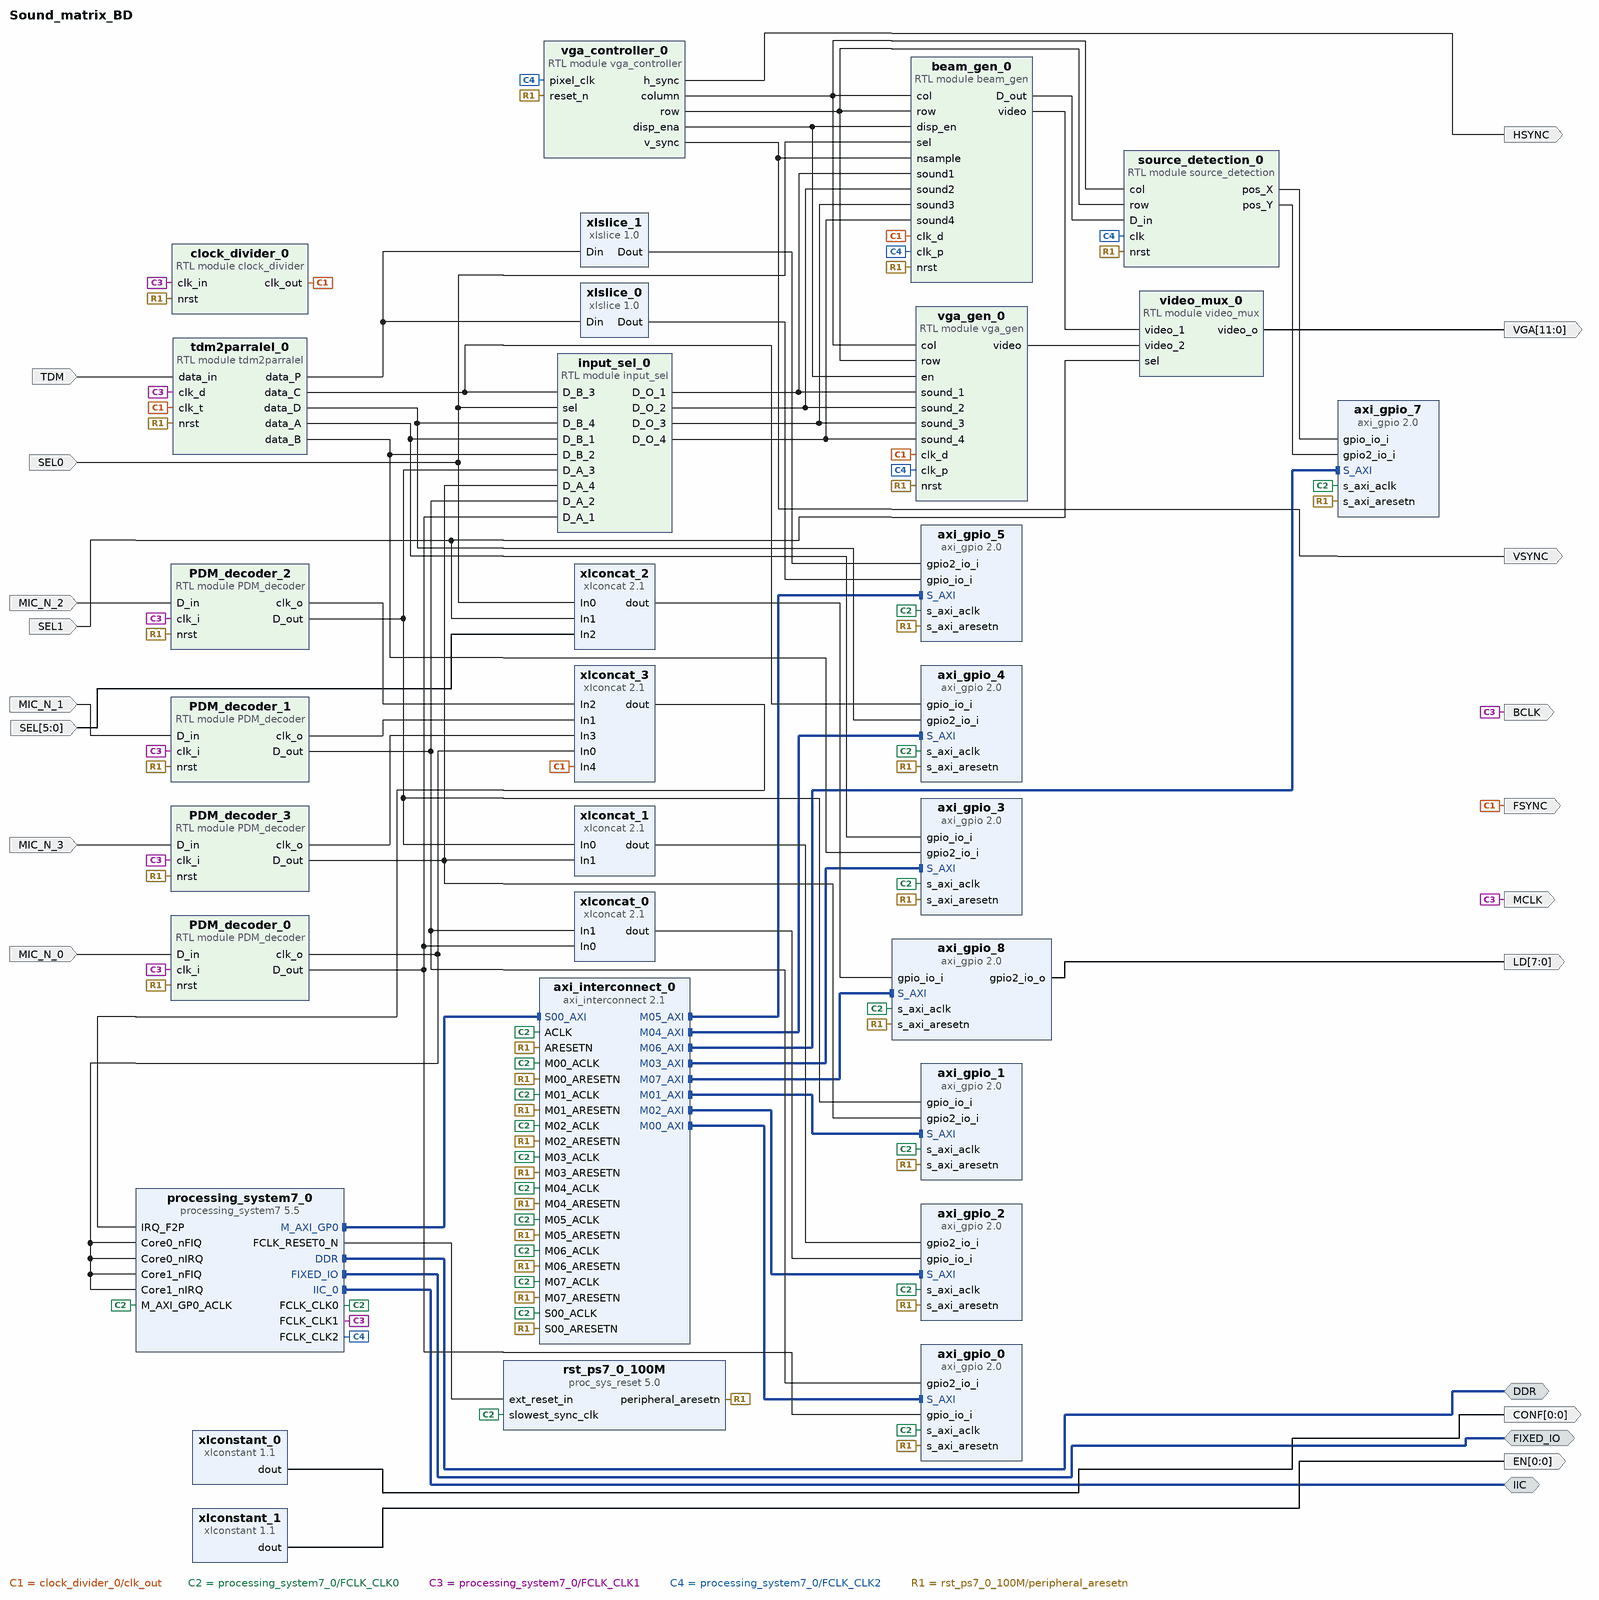
[diagram p0: block diagram of the top level]
# Vivado block design Sound_matrix_BD, xc7z020clg484-1, Vivado 2023.2.2
create_bd_design Sound_matrix_BD

create_bd_intf_port -mode Master -vlnv xilinx.com:interface:ddrx_rtl:1.0 DDR
create_bd_intf_port -mode Master -vlnv xilinx.com:display_processing_system7:fixedio_rtl:1.0 FIXED_IO
create_bd_intf_port -mode Master -vlnv xilinx.com:interface:iic_rtl:1.0 IIC
create_bd_port -dir I -type data MIC_N_0
create_bd_port -dir I -type data MIC_N_1
create_bd_port -dir I -type data MIC_N_2
create_bd_port -dir I -type data MIC_N_3
create_bd_port -dir I -type data TDM
create_bd_port -dir O -type clk MCLK
create_bd_port -dir O -type clk FSYNC
create_bd_port -dir O -type clk BCLK
create_bd_port -dir O -from 0 -to 0 -type data CONF
create_bd_port -dir O -from 0 -to 0 -type data EN
create_bd_port -dir I -type data SEL0
create_bd_port -dir O -type clk HSYNC
create_bd_port -dir O -type clk VSYNC
create_bd_port -dir I -type data SEL1
create_bd_port -dir O -from 11 -to 0 -type data VGA
create_bd_port -dir I -from 5 -to 0 -type data SEL
create_bd_port -dir O -from 7 -to 0 -type data LD

create_bd_cell -type ip -vlnv xilinx.com:ip:processing_system7:5.5 processing_system7_0
set_property -dict [list \
  CONFIG.PCW_APU_PERIPHERAL_FREQMHZ 666.666667 \
  CONFIG.PCW_CORE0_FIQ_INTR 1 \
  CONFIG.PCW_CORE0_IRQ_INTR 1 \
  CONFIG.PCW_CORE1_FIQ_INTR 1 \
  CONFIG.PCW_CORE1_IRQ_INTR 1 \
  CONFIG.PCW_ENET0_ENET0_IO {MIO 16 .. 27} \
  CONFIG.PCW_ENET0_GRP_MDIO_ENABLE 1 \
  CONFIG.PCW_ENET0_GRP_MDIO_IO {MIO 52 .. 53} \
  CONFIG.PCW_ENET0_PERIPHERAL_ENABLE 1 \
  CONFIG.PCW_ENET0_RESET_ENABLE 0 \
  CONFIG.PCW_ENET_RESET_ENABLE 1 \
  CONFIG.PCW_ENET_RESET_SELECT {Share reset pin} \
  CONFIG.PCW_EN_CLK1_PORT 1 \
  CONFIG.PCW_EN_CLK2_PORT 1 \
  CONFIG.PCW_FCLK_CLK1_BUF TRUE \
  CONFIG.PCW_FCLK_CLK2_BUF TRUE \
  CONFIG.PCW_FPGA0_PERIPHERAL_FREQMHZ 100.000000 \
  CONFIG.PCW_FPGA1_PERIPHERAL_FREQMHZ 3.072 \
  CONFIG.PCW_FPGA2_PERIPHERAL_FREQMHZ 25 \
  CONFIG.PCW_FPGA_FCLK1_ENABLE 1 \
  CONFIG.PCW_FPGA_FCLK2_ENABLE 1 \
  CONFIG.PCW_GPIO_EMIO_GPIO_ENABLE 1 \
  CONFIG.PCW_GPIO_EMIO_GPIO_IO 64 \
  CONFIG.PCW_GPIO_MIO_GPIO_ENABLE 1 \
  CONFIG.PCW_GPIO_MIO_GPIO_IO MIO \
  CONFIG.PCW_I2C0_I2C0_IO EMIO \
  CONFIG.PCW_I2C0_PERIPHERAL_ENABLE 1 \
  CONFIG.PCW_I2C_PERIPHERAL_FREQMHZ 111.111115 \
  CONFIG.PCW_I2C_RESET_ENABLE 1 \
  CONFIG.PCW_I2C_RESET_SELECT {Share reset pin} \
  CONFIG.PCW_IRQ_F2P_INTR 1 \
  CONFIG.PCW_PRESET_BANK1_VOLTAGE {LVCMOS 1.8V} \
  CONFIG.PCW_QSPI_GRP_SINGLE_SS_ENABLE 1 \
  CONFIG.PCW_QSPI_GRP_SINGLE_SS_IO {MIO 1 .. 6} \
  CONFIG.PCW_QSPI_PERIPHERAL_ENABLE 1 \
  CONFIG.PCW_QSPI_QSPI_IO {MIO 1 .. 6} \
  CONFIG.PCW_SD0_GRP_CD_ENABLE 1 \
  CONFIG.PCW_SD0_GRP_CD_IO {MIO 47} \
  CONFIG.PCW_SD0_GRP_WP_ENABLE 1 \
  CONFIG.PCW_SD0_GRP_WP_IO {MIO 46} \
  CONFIG.PCW_SD0_PERIPHERAL_ENABLE 1 \
  CONFIG.PCW_SD0_SD0_IO {MIO 40 .. 45} \
  CONFIG.PCW_SDIO_PERIPHERAL_FREQMHZ 50 \
  CONFIG.PCW_SINGLE_QSPI_DATA_MODE x4 \
  CONFIG.PCW_TTC0_PERIPHERAL_ENABLE 1 \
  CONFIG.PCW_TTC0_TTC0_IO EMIO \
  CONFIG.PCW_UART1_PERIPHERAL_ENABLE 1 \
  CONFIG.PCW_UART1_UART1_IO {MIO 48 .. 49} \
  CONFIG.PCW_UART_PERIPHERAL_FREQMHZ 50 \
  CONFIG.PCW_UIPARAM_DDR_FREQ_MHZ 533.333313 \
  CONFIG.PCW_UIPARAM_DDR_PARTNO {MT41J128M16 HA-15E} \
  CONFIG.PCW_USB0_PERIPHERAL_ENABLE 1 \
  CONFIG.PCW_USB0_RESET_ENABLE 0 \
  CONFIG.PCW_USB0_USB0_IO {MIO 28 .. 39} \
  CONFIG.PCW_USB_RESET_ENABLE 1 \
  CONFIG.PCW_USB_RESET_SELECT {Share reset pin} \
  CONFIG.PCW_USE_FABRIC_INTERRUPT 1 \
  CONFIG.preset ZedBoard \
] [get_bd_cells processing_system7_0]
# 228 more settings of processing_system7_0 are not shown: defaults, MIO pin electricals, DDR timing, and values the tool derives
create_bd_cell -type module -reference PDM_decoder PDM_decoder_0
create_bd_cell -type module -reference PDM_decoder PDM_decoder_1
create_bd_cell -type module -reference PDM_decoder PDM_decoder_2
create_bd_cell -type module -reference PDM_decoder PDM_decoder_3
create_bd_cell -type ip -vlnv xilinx.com:ip:axi_interconnect:2.1 axi_interconnect_0
set_property -dict {CONFIG.NUM_MI 8} [get_bd_cells axi_interconnect_0]
create_bd_cell -type ip -vlnv xilinx.com:ip:axi_gpio:2.0 axi_gpio_0
set_property -dict [list \
  CONFIG.C_ALL_INPUTS 1 \
  CONFIG.C_ALL_INPUTS_2 1 \
  CONFIG.C_GPIO2_WIDTH 16 \
  CONFIG.C_GPIO_WIDTH 16 \
  CONFIG.C_IS_DUAL 1 \
] [get_bd_cells axi_gpio_0]
create_bd_cell -type ip -vlnv xilinx.com:ip:axi_gpio:2.0 axi_gpio_1
set_property -dict [list \
  CONFIG.C_ALL_INPUTS 1 \
  CONFIG.C_ALL_INPUTS_2 1 \
  CONFIG.C_GPIO2_WIDTH 16 \
  CONFIG.C_GPIO_WIDTH 16 \
  CONFIG.C_IS_DUAL 1 \
] [get_bd_cells axi_gpio_1]
create_bd_cell -type ip -vlnv xilinx.com:ip:axi_gpio:2.0 axi_gpio_2
set_property -dict {CONFIG.C_ALL_INPUTS 1 CONFIG.C_ALL_INPUTS_2 1 CONFIG.C_IS_DUAL 1} [get_bd_cells axi_gpio_2]
create_bd_cell -type ip -vlnv xilinx.com:ip:xlconcat:2.1 xlconcat_0
set_property -dict {CONFIG.NUM_PORTS 2} [get_bd_cells xlconcat_0]
create_bd_cell -type ip -vlnv xilinx.com:ip:xlconcat:2.1 xlconcat_1
set_property -dict {CONFIG.NUM_PORTS 2} [get_bd_cells xlconcat_1]
create_bd_cell -type ip -vlnv xilinx.com:ip:axi_gpio:2.0 axi_gpio_7
set_property -dict [list \
  CONFIG.C_ALL_INPUTS 1 \
  CONFIG.C_ALL_INPUTS_2 1 \
  CONFIG.C_GPIO2_WIDTH 10 \
  CONFIG.C_GPIO_WIDTH 10 \
  CONFIG.C_IS_DUAL 1 \
] [get_bd_cells axi_gpio_7]
create_bd_cell -type module -reference tdm2parralel tdm2parralel_0
create_bd_cell -type ip -vlnv xilinx.com:ip:axi_gpio:2.0 axi_gpio_3
set_property -dict [list \
  CONFIG.C_ALL_INPUTS 1 \
  CONFIG.C_ALL_INPUTS_2 1 \
  CONFIG.C_GPIO2_WIDTH 16 \
  CONFIG.C_GPIO_WIDTH 16 \
  CONFIG.C_IS_DUAL 1 \
] [get_bd_cells axi_gpio_3]
create_bd_cell -type ip -vlnv xilinx.com:ip:axi_gpio:2.0 axi_gpio_4
set_property -dict [list \
  CONFIG.C_ALL_INPUTS 1 \
  CONFIG.C_ALL_INPUTS_2 1 \
  CONFIG.C_GPIO2_WIDTH 16 \
  CONFIG.C_GPIO_WIDTH 16 \
  CONFIG.C_IS_DUAL 1 \
] [get_bd_cells axi_gpio_4]
create_bd_cell -type ip -vlnv xilinx.com:ip:axi_gpio:2.0 axi_gpio_5
set_property -dict [list \
  CONFIG.C_ALL_INPUTS 1 \
  CONFIG.C_ALL_INPUTS_2 1 \
  CONFIG.C_GPIO2_WIDTH 32 \
  CONFIG.C_GPIO_WIDTH 32 \
  CONFIG.C_IS_DUAL 1 \
] [get_bd_cells axi_gpio_5]
create_bd_cell -type ip -vlnv xilinx.com:ip:xlslice:1.0 xlslice_0
set_property -dict {CONFIG.DIN_FROM 31 CONFIG.DIN_TO 0 CONFIG.DIN_WIDTH 64} [get_bd_cells xlslice_0]
create_bd_cell -type ip -vlnv xilinx.com:ip:xlslice:1.0 xlslice_1
set_property -dict {CONFIG.DIN_FROM 63 CONFIG.DIN_TO 32 CONFIG.DIN_WIDTH 64} [get_bd_cells xlslice_1]
create_bd_cell -type module -reference clock_divider clock_divider_0
create_bd_cell -type ip -vlnv xilinx.com:ip:xlconstant:1.1 xlconstant_0
set_property -dict {CONFIG.CONST_VAL 0} [get_bd_cells xlconstant_0]
create_bd_cell -type ip -vlnv xilinx.com:ip:xlconstant:1.1 xlconstant_1
create_bd_cell -type module -reference input_sel input_sel_0
create_bd_cell -type module -reference vga_controller vga_controller_0
create_bd_cell -type module -reference vga_gen vga_gen_0
set_property -dict [list \
  CONFIG.AVG_2_NUM 0 \
  CONFIG.AVG_NUM 1 \
  CONFIG.H_SPACE 160 \
  CONFIG.LINE_BUF 20 \
  CONFIG.MAX_BUFF 6 \
  CONFIG.V_SPACE 60 \
] [get_bd_cells vga_gen_0]
create_bd_cell -type module -reference video_mux video_mux_0
create_bd_cell -type module -reference beam_gen beam_gen_0
set_property -dict {CONFIG.MAX_SEL 8} [get_bd_cells beam_gen_0]
create_bd_cell -type ip -vlnv xilinx.com:ip:axi_gpio:2.0 axi_gpio_8
set_property -dict [list \
  CONFIG.C_ALL_INPUTS 1 \
  CONFIG.C_ALL_INPUTS_2 0 \
  CONFIG.C_ALL_OUTPUTS_2 1 \
  CONFIG.C_GPIO2_WIDTH 8 \
  CONFIG.C_GPIO_WIDTH 8 \
  CONFIG.C_IS_DUAL 1 \
] [get_bd_cells axi_gpio_8]
create_bd_cell -type ip -vlnv xilinx.com:ip:proc_sys_reset:5.0 rst_ps7_0_100M
create_bd_cell -type ip -vlnv xilinx.com:ip:xlconcat:2.1 xlconcat_2
set_property -dict {CONFIG.NUM_PORTS 3} [get_bd_cells xlconcat_2]
create_bd_cell -type module -reference source_detection source_detection_0
create_bd_cell -type ip -vlnv xilinx.com:ip:xlconcat:2.1 xlconcat_3
set_property -dict {CONFIG.NUM_PORTS 5} [get_bd_cells xlconcat_3]

# ---- connections ----

connect_bd_intf_net [get_bd_intf_pins axi_interconnect_0/S00_AXI] [get_bd_intf_pins processing_system7_0/M_AXI_GP0]
connect_bd_intf_net [get_bd_intf_pins axi_interconnect_0/M00_AXI] [get_bd_intf_pins axi_gpio_0/S_AXI]
connect_bd_intf_net [get_bd_intf_pins axi_interconnect_0/M01_AXI] [get_bd_intf_pins axi_gpio_1/S_AXI]
connect_bd_intf_net [get_bd_intf_pins axi_interconnect_0/M02_AXI] [get_bd_intf_pins axi_gpio_2/S_AXI]
connect_bd_intf_net [get_bd_intf_pins axi_interconnect_0/M03_AXI] [get_bd_intf_pins axi_gpio_3/S_AXI]
connect_bd_intf_net [get_bd_intf_pins axi_interconnect_0/M04_AXI] [get_bd_intf_pins axi_gpio_4/S_AXI]
connect_bd_intf_net [get_bd_intf_pins axi_interconnect_0/M05_AXI] [get_bd_intf_pins axi_gpio_5/S_AXI]
connect_bd_intf_net [get_bd_intf_pins axi_gpio_7/S_AXI] [get_bd_intf_pins axi_interconnect_0/M06_AXI]
connect_bd_intf_net [get_bd_intf_pins axi_gpio_8/S_AXI] [get_bd_intf_pins axi_interconnect_0/M07_AXI]
connect_bd_intf_net [get_bd_intf_ports DDR] [get_bd_intf_pins processing_system7_0/DDR]
connect_bd_intf_net [get_bd_intf_ports FIXED_IO] [get_bd_intf_pins processing_system7_0/FIXED_IO]
connect_bd_intf_net [get_bd_intf_ports IIC] [get_bd_intf_pins processing_system7_0/IIC_0]
connect_bd_net -net MIC_N_0_1 [get_bd_ports MIC_N_0] [get_bd_pins PDM_decoder_0/D_in]
connect_bd_net -net MIC_N_1_1 [get_bd_ports MIC_N_1] [get_bd_pins PDM_decoder_1/D_in]
connect_bd_net -net MIC_N_2_1 [get_bd_ports MIC_N_2] [get_bd_pins PDM_decoder_2/D_in]
connect_bd_net -net MIC_N_3_1 [get_bd_ports MIC_N_3] [get_bd_pins PDM_decoder_3/D_in]
connect_bd_net [get_bd_pins PDM_decoder_0/D_out] [get_bd_pins axi_gpio_0/gpio_io_i] [get_bd_pins xlconcat_0/In0] [get_bd_pins input_sel_0/D_A_1]
connect_bd_net [get_bd_pins PDM_decoder_0/clk_o] \
  [get_bd_pins xlconcat_3/In0] [get_bd_pins processing_system7_0/Core1_nIRQ] [get_bd_pins processing_system7_0/Core1_nFIQ] \
  [get_bd_pins processing_system7_0/Core0_nFIQ] [get_bd_pins processing_system7_0/Core0_nIRQ]
connect_bd_net [get_bd_pins PDM_decoder_1/D_out] [get_bd_pins axi_gpio_0/gpio2_io_i] [get_bd_pins xlconcat_0/In1] [get_bd_pins input_sel_0/D_A_2]
connect_bd_net [get_bd_pins PDM_decoder_1/clk_o] [get_bd_pins xlconcat_3/In1]
connect_bd_net [get_bd_pins PDM_decoder_2/D_out] [get_bd_pins axi_gpio_1/gpio_io_i] [get_bd_pins xlconcat_1/In0] [get_bd_pins input_sel_0/D_A_3]
connect_bd_net [get_bd_pins PDM_decoder_2/clk_o] [get_bd_pins xlconcat_3/In2]
connect_bd_net [get_bd_pins PDM_decoder_3/D_out] [get_bd_pins axi_gpio_1/gpio2_io_i] [get_bd_pins xlconcat_1/In1] [get_bd_pins input_sel_0/D_A_4]
connect_bd_net [get_bd_pins PDM_decoder_3/clk_o] [get_bd_pins xlconcat_3/In3]
connect_bd_net -net SEL0_1 [get_bd_ports SEL0] [get_bd_pins input_sel_0/sel] [get_bd_pins xlconcat_2/In0] [get_bd_pins beam_gen_0/sel]
connect_bd_net -net SEL1_1 [get_bd_ports SEL1] [get_bd_pins video_mux_0/sel] [get_bd_pins xlconcat_2/In1]
connect_bd_net [get_bd_ports SEL] [get_bd_pins xlconcat_2/In2]
connect_bd_net [get_bd_ports TDM] [get_bd_pins tdm2parralel_0/data_in]
connect_bd_net [get_bd_pins axi_gpio_8/gpio2_io_o] [get_bd_ports LD]
connect_bd_net [get_bd_pins beam_gen_0/D_out] [get_bd_pins source_detection_0/D_in]
connect_bd_net [get_bd_pins beam_gen_0/video] [get_bd_pins video_mux_0/video_1]
connect_bd_net [get_bd_pins clock_divider_0/clk_out] \
  [get_bd_ports FSYNC] [get_bd_pins tdm2parralel_0/clk_t] [get_bd_pins vga_gen_0/clk_d] [get_bd_pins xlconcat_3/In4] \
  [get_bd_pins beam_gen_0/clk_d]
connect_bd_net [get_bd_pins input_sel_0/D_O_1] [get_bd_pins vga_gen_0/sound_1] [get_bd_pins beam_gen_0/sound1]
connect_bd_net [get_bd_pins input_sel_0/D_O_2] [get_bd_pins vga_gen_0/sound_2] [get_bd_pins beam_gen_0/sound2]
connect_bd_net [get_bd_pins input_sel_0/D_O_3] [get_bd_pins vga_gen_0/sound_3] [get_bd_pins beam_gen_0/sound3]
connect_bd_net [get_bd_pins input_sel_0/D_O_4] [get_bd_pins vga_gen_0/sound_4] [get_bd_pins beam_gen_0/sound4]
connect_bd_net [get_bd_pins processing_system7_0/FCLK_CLK0] \
  [get_bd_pins processing_system7_0/M_AXI_GP0_ACLK] [get_bd_pins axi_gpio_0/s_axi_aclk] \
  [get_bd_pins axi_interconnect_0/M00_ACLK] [get_bd_pins rst_ps7_0_100M/slowest_sync_clk] [get_bd_pins axi_gpio_1/s_axi_aclk] \
  [get_bd_pins axi_interconnect_0/M01_ACLK] [get_bd_pins axi_gpio_2/s_axi_aclk] [get_bd_pins axi_interconnect_0/M02_ACLK] \
  [get_bd_pins axi_gpio_3/s_axi_aclk] [get_bd_pins axi_interconnect_0/M03_ACLK] [get_bd_pins axi_gpio_4/s_axi_aclk] \
  [get_bd_pins axi_interconnect_0/M04_ACLK] [get_bd_pins axi_gpio_5/s_axi_aclk] [get_bd_pins axi_interconnect_0/M05_ACLK] \
  [get_bd_pins axi_gpio_7/s_axi_aclk] [get_bd_pins axi_interconnect_0/M06_ACLK] [get_bd_pins axi_gpio_8/s_axi_aclk] \
  [get_bd_pins axi_interconnect_0/M07_ACLK] [get_bd_pins axi_interconnect_0/ACLK] [get_bd_pins axi_interconnect_0/S00_ACLK]
connect_bd_net [get_bd_pins processing_system7_0/FCLK_CLK1] \
  [get_bd_ports MCLK] [get_bd_pins clock_divider_0/clk_in] [get_bd_pins tdm2parralel_0/clk_d] [get_bd_ports BCLK] \
  [get_bd_pins PDM_decoder_0/clk_i] [get_bd_pins PDM_decoder_1/clk_i] [get_bd_pins PDM_decoder_2/clk_i] \
  [get_bd_pins PDM_decoder_3/clk_i]
connect_bd_net [get_bd_pins processing_system7_0/FCLK_CLK2] \
  [get_bd_pins vga_controller_0/pixel_clk] [get_bd_pins vga_gen_0/clk_p] [get_bd_pins beam_gen_0/clk_p] \
  [get_bd_pins source_detection_0/clk]
connect_bd_net [get_bd_pins processing_system7_0/FCLK_RESET0_N] [get_bd_pins rst_ps7_0_100M/ext_reset_in]
connect_bd_net [get_bd_pins rst_ps7_0_100M/peripheral_aresetn] \
  [get_bd_pins axi_gpio_0/s_axi_aresetn] [get_bd_pins axi_interconnect_0/M00_ARESETN] [get_bd_pins axi_gpio_1/s_axi_aresetn] \
  [get_bd_pins axi_interconnect_0/M01_ARESETN] [get_bd_pins axi_gpio_2/s_axi_aresetn] \
  [get_bd_pins axi_interconnect_0/M02_ARESETN] [get_bd_pins axi_gpio_3/s_axi_aresetn] \
  [get_bd_pins axi_interconnect_0/M03_ARESETN] [get_bd_pins axi_gpio_4/s_axi_aresetn] \
  [get_bd_pins axi_interconnect_0/M04_ARESETN] [get_bd_pins axi_gpio_5/s_axi_aresetn] \
  [get_bd_pins axi_interconnect_0/M05_ARESETN] [get_bd_pins axi_gpio_7/s_axi_aresetn] \
  [get_bd_pins axi_interconnect_0/M06_ARESETN] [get_bd_pins axi_gpio_8/s_axi_aresetn] \
  [get_bd_pins axi_interconnect_0/M07_ARESETN] [get_bd_pins axi_interconnect_0/ARESETN] \
  [get_bd_pins axi_interconnect_0/S00_ARESETN] [get_bd_pins vga_gen_0/nrst] [get_bd_pins vga_controller_0/reset_n] \
  [get_bd_pins tdm2parralel_0/nrst] [get_bd_pins clock_divider_0/nrst] [get_bd_pins beam_gen_0/nrst] \
  [get_bd_pins source_detection_0/nrst] [get_bd_pins PDM_decoder_0/nrst] [get_bd_pins PDM_decoder_1/nrst] \
  [get_bd_pins PDM_decoder_2/nrst] [get_bd_pins PDM_decoder_3/nrst]
connect_bd_net [get_bd_pins source_detection_0/pos_X] [get_bd_pins axi_gpio_7/gpio_io_i]
connect_bd_net [get_bd_pins source_detection_0/pos_Y] [get_bd_pins axi_gpio_7/gpio2_io_i]
connect_bd_net [get_bd_pins tdm2parralel_0/data_A] [get_bd_pins axi_gpio_3/gpio_io_i] [get_bd_pins input_sel_0/D_B_1]
connect_bd_net [get_bd_pins tdm2parralel_0/data_B] [get_bd_pins axi_gpio_3/gpio2_io_i] [get_bd_pins input_sel_0/D_B_2]
connect_bd_net [get_bd_pins tdm2parralel_0/data_C] [get_bd_pins axi_gpio_4/gpio_io_i] [get_bd_pins input_sel_0/D_B_3]
connect_bd_net [get_bd_pins tdm2parralel_0/data_D] [get_bd_pins axi_gpio_4/gpio2_io_i] [get_bd_pins input_sel_0/D_B_4]
connect_bd_net [get_bd_pins tdm2parralel_0/data_P] [get_bd_pins xlslice_0/Din] [get_bd_pins xlslice_1/Din]
connect_bd_net [get_bd_pins vga_controller_0/column] [get_bd_pins vga_gen_0/col] [get_bd_pins beam_gen_0/col] [get_bd_pins source_detection_0/col]
connect_bd_net [get_bd_pins vga_controller_0/disp_ena] [get_bd_pins vga_gen_0/en] [get_bd_pins beam_gen_0/disp_en]
connect_bd_net [get_bd_pins vga_controller_0/h_sync] [get_bd_ports HSYNC]
connect_bd_net [get_bd_pins vga_controller_0/row] [get_bd_pins vga_gen_0/row] [get_bd_pins beam_gen_0/row] [get_bd_pins source_detection_0/row]
connect_bd_net [get_bd_pins vga_controller_0/v_sync] [get_bd_ports VSYNC] [get_bd_pins beam_gen_0/nsample]
connect_bd_net [get_bd_pins vga_gen_0/video] [get_bd_pins video_mux_0/video_2]
connect_bd_net [get_bd_pins video_mux_0/video_o] [get_bd_ports VGA]
connect_bd_net [get_bd_pins xlconcat_0/dout] [get_bd_pins axi_gpio_2/gpio_io_i]
connect_bd_net [get_bd_pins xlconcat_1/dout] [get_bd_pins axi_gpio_2/gpio2_io_i]
connect_bd_net [get_bd_pins xlconcat_2/dout] [get_bd_pins axi_gpio_8/gpio_io_i]
connect_bd_net [get_bd_pins xlconcat_3/dout] [get_bd_pins processing_system7_0/IRQ_F2P]
connect_bd_net [get_bd_pins xlconstant_0/dout] [get_bd_ports CONF]
connect_bd_net [get_bd_pins xlconstant_1/dout] [get_bd_ports EN]
connect_bd_net [get_bd_pins xlslice_0/Dout] [get_bd_pins axi_gpio_5/gpio_io_i]
connect_bd_net [get_bd_pins xlslice_1/Dout] [get_bd_pins axi_gpio_5/gpio2_io_i]

# ---- address map ----
assign_bd_address -offset 0x41200000 -range 64K -target_address_space [get_bd_addr_spaces processing_system7_0/Data] [get_bd_addr_segs axi_gpio_0/S_AXI/Reg]
assign_bd_address -offset 0x41210000 -range 64K -target_address_space [get_bd_addr_spaces processing_system7_0/Data] [get_bd_addr_segs axi_gpio_1/S_AXI/Reg]
assign_bd_address -offset 0x41220000 -range 64K -target_address_space [get_bd_addr_spaces processing_system7_0/Data] [get_bd_addr_segs axi_gpio_2/S_AXI/Reg]
assign_bd_address -offset 0x41230000 -range 64K -target_address_space [get_bd_addr_spaces processing_system7_0/Data] [get_bd_addr_segs axi_gpio_3/S_AXI/Reg]
assign_bd_address -offset 0x41240000 -range 64K -target_address_space [get_bd_addr_spaces processing_system7_0/Data] [get_bd_addr_segs axi_gpio_4/S_AXI/Reg]
assign_bd_address -offset 0x41250000 -range 64K -target_address_space [get_bd_addr_spaces processing_system7_0/Data] [get_bd_addr_segs axi_gpio_5/S_AXI/Reg]
assign_bd_address -offset 0x41260000 -range 64K -target_address_space [get_bd_addr_spaces processing_system7_0/Data] [get_bd_addr_segs axi_gpio_7/S_AXI/Reg]
assign_bd_address -offset 0x41270000 -range 64K -target_address_space [get_bd_addr_spaces processing_system7_0/Data] [get_bd_addr_segs axi_gpio_8/S_AXI/Reg]

validate_bd_design
save_bd_design
